# EAGLE design command_radiateur (EAGLE 6.6.0)
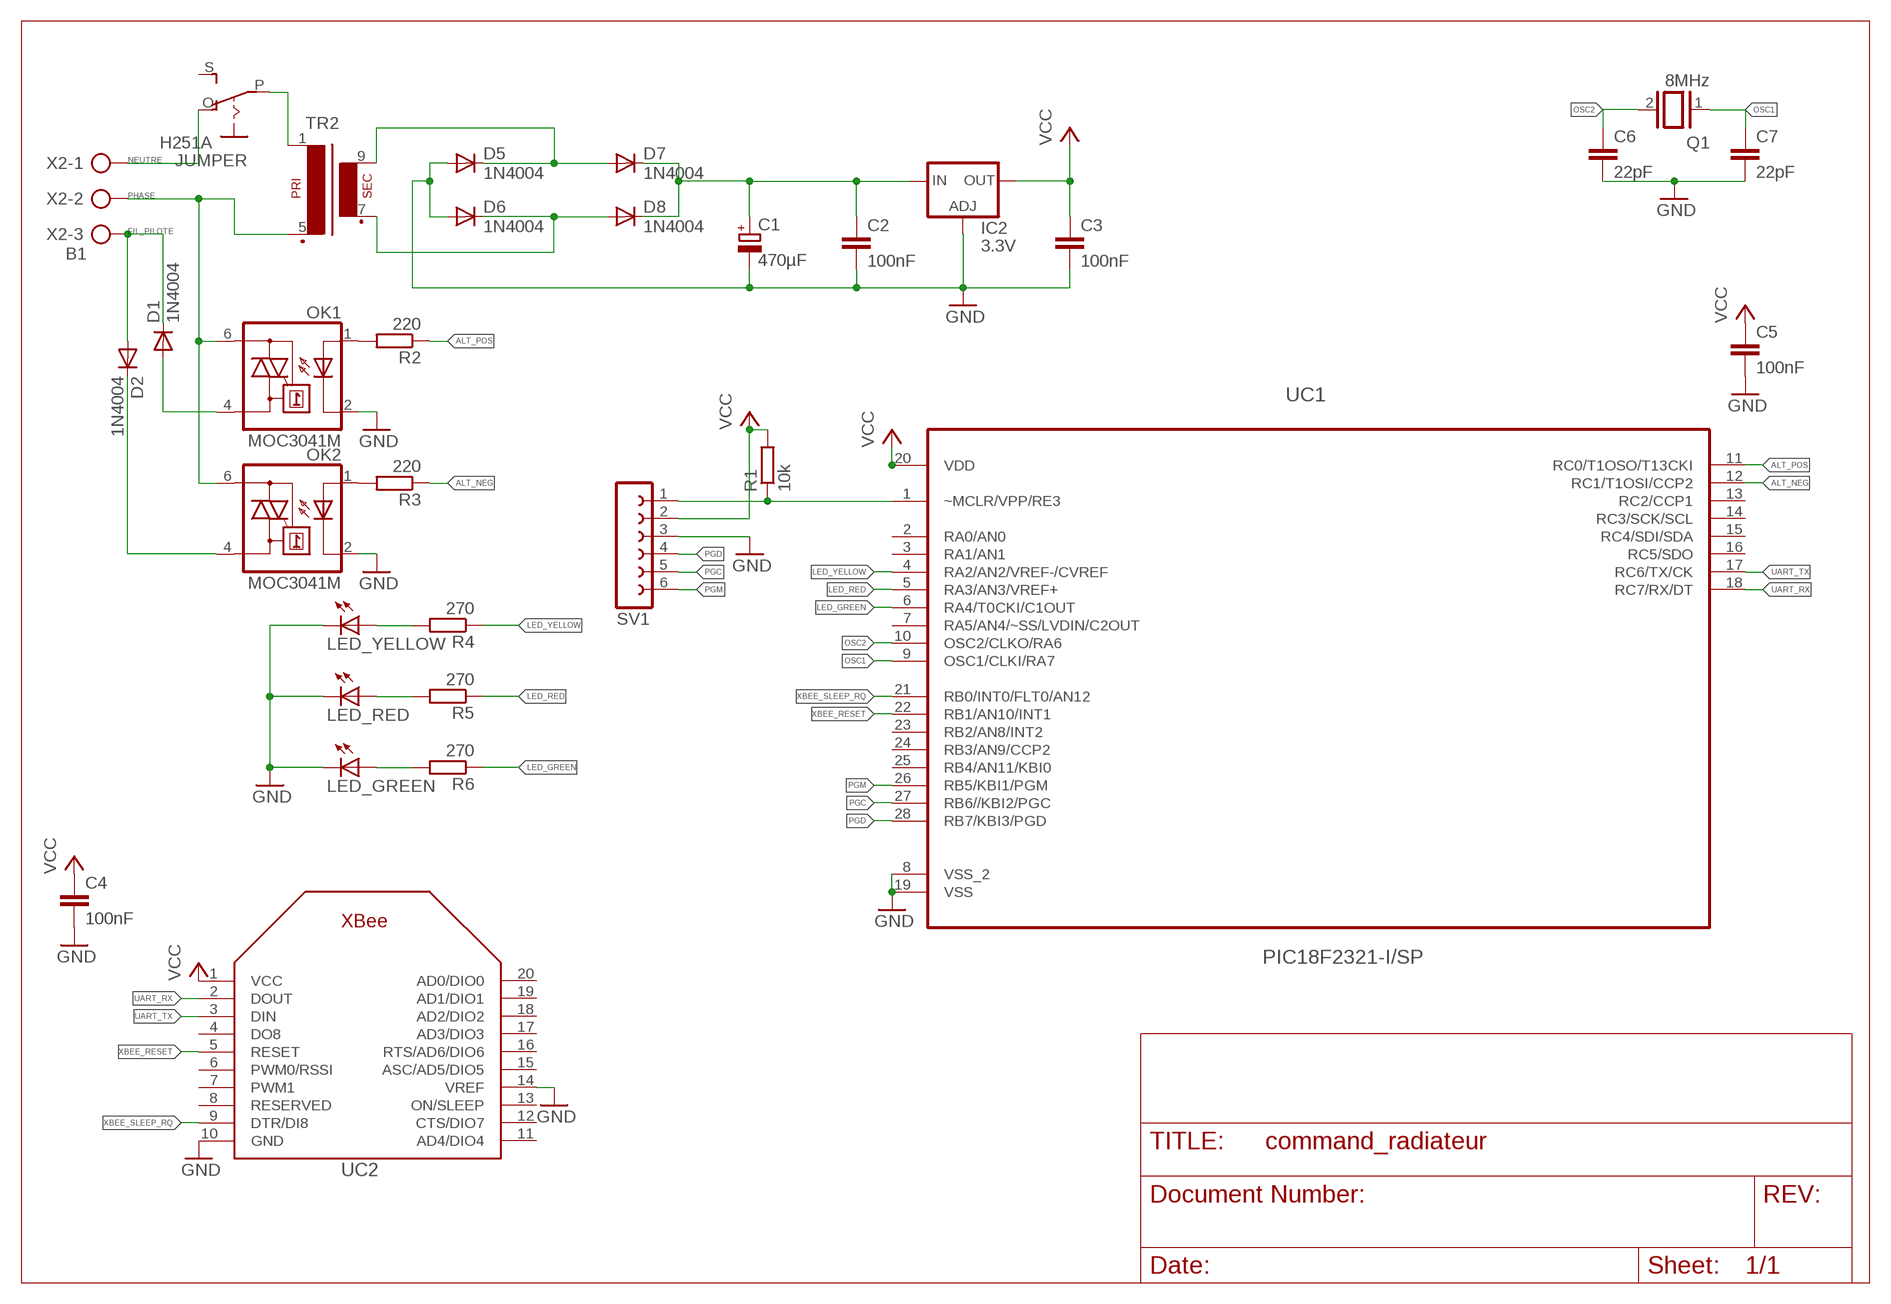
[diagram p0: schematic, sheet 1]

## Parts
C1  470µF  CPOL-EUE5-10.5  [E5-10,5]
C2  100nF  C-EU050-030X075  [C050-030X075]
C3  100nF  C-EU050-030X075  [C050-030X075]
C4  100nF  C-EU050-030X075  [C050-030X075]
C5  100nF  C-EU050-030X075  [C050-030X075]
C6  22pF  C-EU025-024X044  [C025-024X044]
C7  22pF  C-EU025-024X044  [C025-024X044]
D1  1N4004  [DO41-10]
D2  1N4004  [DO41-10]
D5  1N4004  [DO41-10]
D6  1N4004  [DO41-10]
D7  1N4004  [DO41-10]
D8  1N4004  [DO41-10]
IC2  3.3V  LM317TS  [317TS]
JUMPER  H251A  [H251A]
LED_GREEN  LED3MM  [LED3MM]
LED_RED  LED3MM  [LED3MM]
LED_YELLOW  LED3MM  [LED3MM]
OK1  MOC3041M  [DIL06]
OK2  MOC3041M  [DIL06]
Q1  8MHz  XTAL/S  [QS]
R1  10k  R-EU_0204/7  [0204/7]
R2  220  R-EU_0204/7  [0204/7]
R3  220  R-EU_0204/7  [0204/7]
R4  270  R-EU_0204/7  [0204/7]
R5  270  R-EU_0204/7  [0204/7]
R6  270  R-EU_0204/7  [0204/7]
SV1  FE06-1  [FE06]
TR2  VV11  [VV11]
UC1  PIC18F2321-I/SP  [DIP254P762X508-28]
UC2  XBEE  [XBEE]
X2  B1  AK300/3  [AK300/3]

## Nets
ALT_NEG: R3.1 UC1.12(RC1/T1OSI/CCP2)
ALT_POS: R2.1 UC1.11(RC0/T1OSO/T13CKI)
FIL_PILOTE: D1.C D2.A X2.3
GND: C1.- C2.2 C3.2 C4.2 C5.2 C6.2 C7.2 D5.A D6.A IC2.1(ADJ) LED_GREEN.K(C) LED_RED.K(C) LED_YELLOW.K(C) OK1.2(C) OK2.2(C) SV1.3 UC1.8(VSS_2) UC1.19(VSS) UC2.10(GND) UC2.14(VREF)
LED_GREEN: R6.1 UC1.6(RA4/T0CKI/C1OUT)
LED_RED: R5.1 UC1.5(RA3/AN3/VREF+)
LED_YELLOW: R4.1 UC1.4(RA2/AN2/VREF-/CVREF)
N1: JUMPER.P TR2.1
N$1: R1.1 SV1.1 UC1.1(~MCLR/VPP/RE3)
N$2: OK1.1(A) R2.2
N$3: OK2.1(A) R3.2
N$4: D1.A OK1.4(A1)
N$7: D5.C D7.A TR2.9(S4)
N$8: D6.C D8.A TR2.7(S3)
N$10: C1.+ C2.1 D7.C D8.C IC2.3(IN)
N$11: D2.C OK2.4(A1)
N$12: LED_YELLOW.A R4.2
N$13: LED_RED.A R5.2
N$14: LED_GREEN.A R6.2
NEUTRE: JUMPER.O X2.1
OSC1: C7.1 Q1.1 UC1.9(OSC1/CLKI/RA7)
OSC2: C6.1 Q1.2 UC1.10(OSC2/CLKO/RA6)
PGC: SV1.5 UC1.27(RB6//KBI2/PGC)
PGD: SV1.4 UC1.28(RB7/KBI3/PGD)
PGM: SV1.6 UC1.26(RB5/KBI1/PGM)
PHASE: OK1.6(A2) OK2.6(A2) TR2.5(P2) X2.2
UART_RX: UC1.18(RC7/RX/DT) UC2.2(DOUT)
UART_TX: UC1.17(RC6/TX/CK) UC2.3(DIN)
VCC: C3.1 C4.1 C5.1 IC2.2(OUT) R1.2 SV1.2 UC1.20(VDD) UC2.1(VCC)
XBEE_RESET: UC1.22(RB1/AN10/INT1) UC2.5(RESET)
XBEE_SLEEP_RQ: UC1.21(RB0/INT0/FLT0/AN12) UC2.9(DTR/DI8)
Unconnected: JUMPER.S UC1.2(RA0/AN0) UC1.3(RA1/AN1) UC1.7(RA5/AN4/~SS/LVDIN/C2OUT) UC1.13(RC2/CCP1) UC1.14(RC3/SCK/SCL) UC1.15(RC4/SDI/SDA) UC1.16(RC5/SDO) UC1.23(RB2/AN8/INT2) UC1.24(RB3/AN9/CCP2) UC1.25(RB4/AN11/KBI0) UC2.4(DO8) UC2.6(PWM0/RSSI) UC2.7(PWM1) UC2.8(RESERVED) UC2.11(AD4/DIO4) UC2.12(CTS/DIO7) UC2.13(ON/SLEEP) UC2.15(ASC/AD5/DIO5) UC2.16(RTS/AD6/DIO6) UC2.17(AD3/DIO3) UC2.18(AD2/DIO2) UC2.19(AD1/DIO1) UC2.20(AD0/DIO0)

## Library data of the parts
C1 = rcl:CPOL-EU: POLARIZED CAPACITOR, European symbol
C2-C7 = rcl:C-EU: CAPACITOR, European symbol
D1 D2 D5-D8 = diode:1N4004: DIODE general purpose rectifier, 1 A
IC2 = v-reg:LM317TS: VOLTAGE REGULATOR
JUMPER = ma_libs:H251A: Inverseur unipolaire H251A
LED_GREEN LED_RED LED_YELLOW = led:LED: LED OSRAM: - CHIPLED LG R971, LG N971, LY N971, LG Q971, LY Q971, LO R971, LY R971 LH N974, LH R974 LS Q976, LO Q976, LY Q976 LO Q996 - Hyper CHIPLED LW Q18S LB Q993, LB Q99A, LB R99A - SideLED LS A670, LO A670, LY A670, LG A670, LP A670 LB A673, LV A673, LT A673, LW A673 LH A674 LY A675 LS A676, LA A676, LO A676, LY A676, LW A676 LS A679, LY A679, LG A679 - Hyper Micro SIDELED® LS Y876, LA Y876, LO Y876, LY Y876 LT Y87S - SmartLED LW L88C, LW L88S LB L89C, LB L89S, LG L890 LS L89K, LO L89K, LY L89K LS L896, LA L896, LO L896, LY L896 - TOPLED LS T670, LO T670, LY T670, LG T670, LP T670 LSG T670, LSP T670, LSY T670, LOP T670, LYG T670 LG T671, LOG T671, LSG T671 LB T673, LV T673, LT T673, LW T673 LH T674 LS T676, LA T676, LO T676, LY T676, LB T676, LH T676, LSB T676, LW T676 LB T67C, LV T67C, LT T67C, LS T67K, LO T67K, LY T67K, LW E67C LS E67B, LA E67B, LO E67B, LY E67B, LB E67C, LV E67C, LT E67C LW T67C LS T679, LY T679, LG T679 LS T770, LO T770, LY T770, LG T770, LP T770 LB T773, LV T773, LT T773, LW T773 LH T774 LS E675, LA E675, LY E675, LS T675 LS T776, LA T776, LO T776, LY T776, LB T776 LHGB T686 LT T68C, LB T68C - Hyper Mini TOPLED® LB M676 - Mini TOPLED Santana® LG M470 LS M47K, LO M47K, LY M47K Source: http://www.osram.convergy.de LUXEON: - LUMILED® LXK2-PW12-R00, LXK2-PW12-S00, LXK2-PW14-U00, LXK2-PW14-V00 LXK2-PM12-R00, LXK2-PM12-S00, LXK2-PM14-U00 LXK2-PE12-Q00, LXK2-PE12-R00, LXK2-PE12-S00, LXK2-PE14-T00, LXK2-PE14-U00 LXK2-PB12-K00, LXK2-PB12-L00, LXK2-PB12-M00, LXK2-PB14-N00, LXK2-PB14-P00, LXK2-PB14-Q00 LXK2-PR12-L00, LXK2-PR12-M00, LXK2-PR14-Q00, LXK2-PR14-R00 LXK2-PD12-Q00, LXK2-PD12-R00, LXK2-PD12-S00 LXK2-PH12-R00, LXK2-PH12-S00 LXK2-PL12-P00, LXK2-PL12-Q00, LXK2-PL12-R00 Source: www.luxeon.com KINGBRIGHT: KA-3528ASYC Source: www.kingbright.com
OK1 OK2 = optocoupler:MOC30*: 6-Pin DIP Zero-Cross Optoisolators Triac Driver Output (250/400 Volt Peak) Source: Data sheet <http://www.fairchildsemi.com/ds/MO/MOC3031M.pdf> The old path of data sheet not more available 2013-05-06.; MF: FAIRCHILD SEMICONDUCTOR; MPN: MOC3041M; OC_FARNELL: 1086677; OC_NEWARK: 78K6090
Q1 = special:XTAL/S: CRYSTAL
R1-R6 = rcl:R-EU_: RESISTOR, European symbol
SV1 = con-lsta:FE06-1: FEMALE HEADER; OC_FARNELL: unknown; OC_NEWARK: unknown
TR2 = trafo:VV11: TRANSFORMER 1 primary winding, 1 secondary winding BLOCK
UC1 = Microchip_By_element14_Batch_1:PIC18F2321-I/SP: High-Performance Enhanced Flash Microcontrollers; MPN: PIC18F2321-I/SP; OC_FARNELL: 1332236; OC_NEWARK: 31K5012; PACKAGE: DIP-28; SUPPLIER: Microchip
UC2 = adafruit:XBEE
X2 = con-ptr500:AK300/3: CONNECTOR; OC_FARNELL: unknown; OC_NEWARK: unknown

## Board
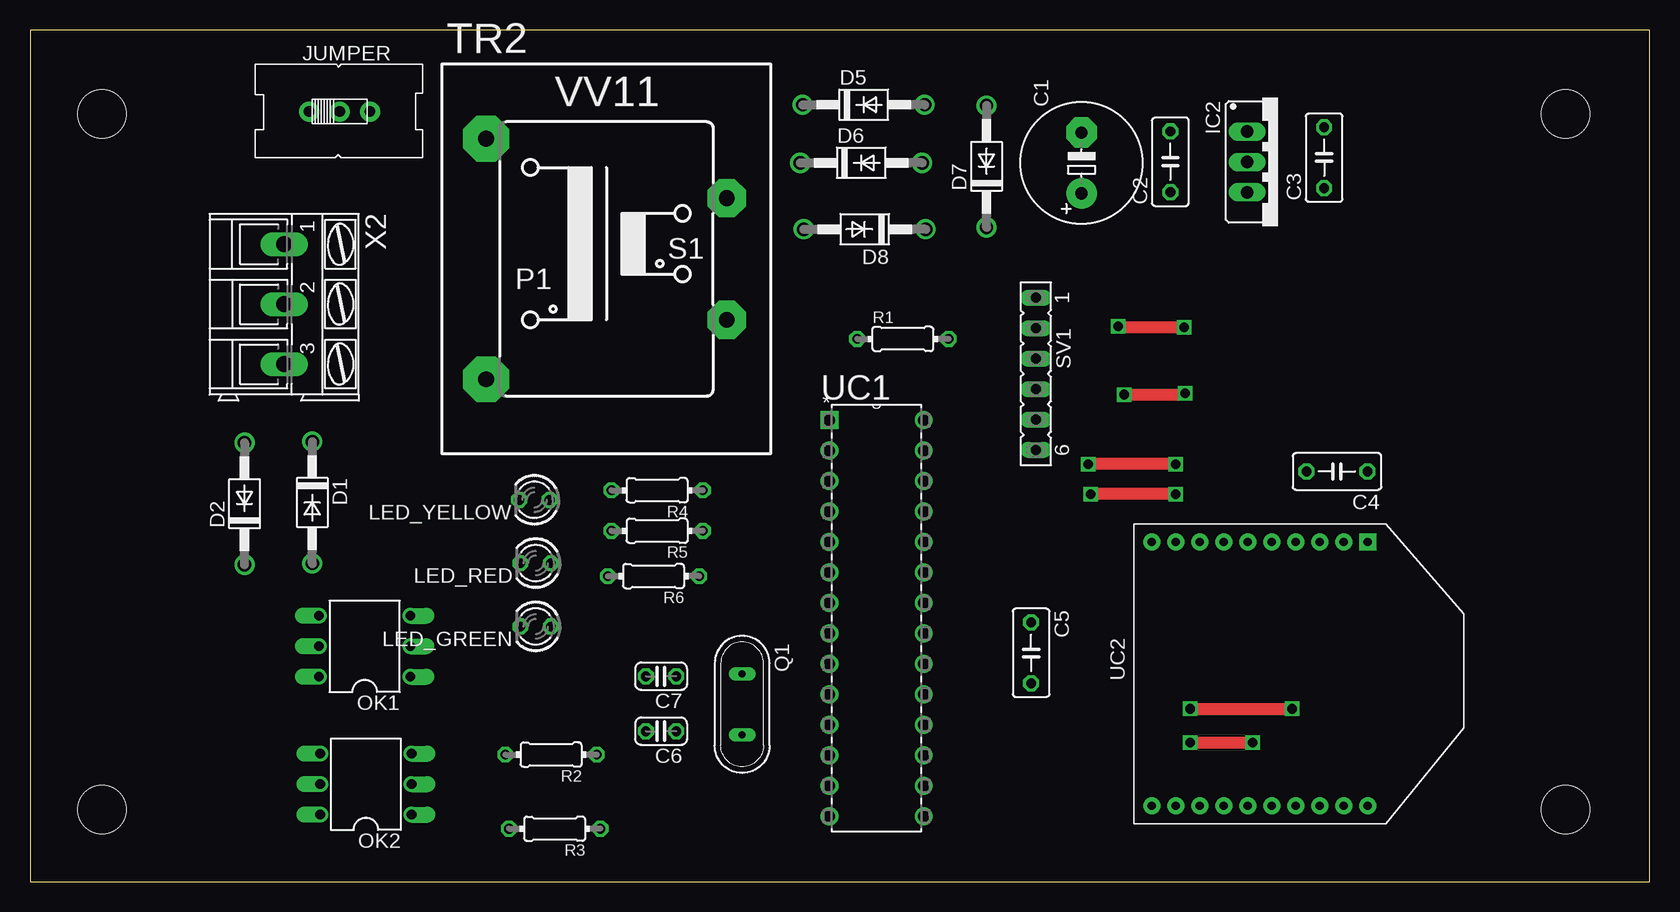
[diagram p1: board, top side]
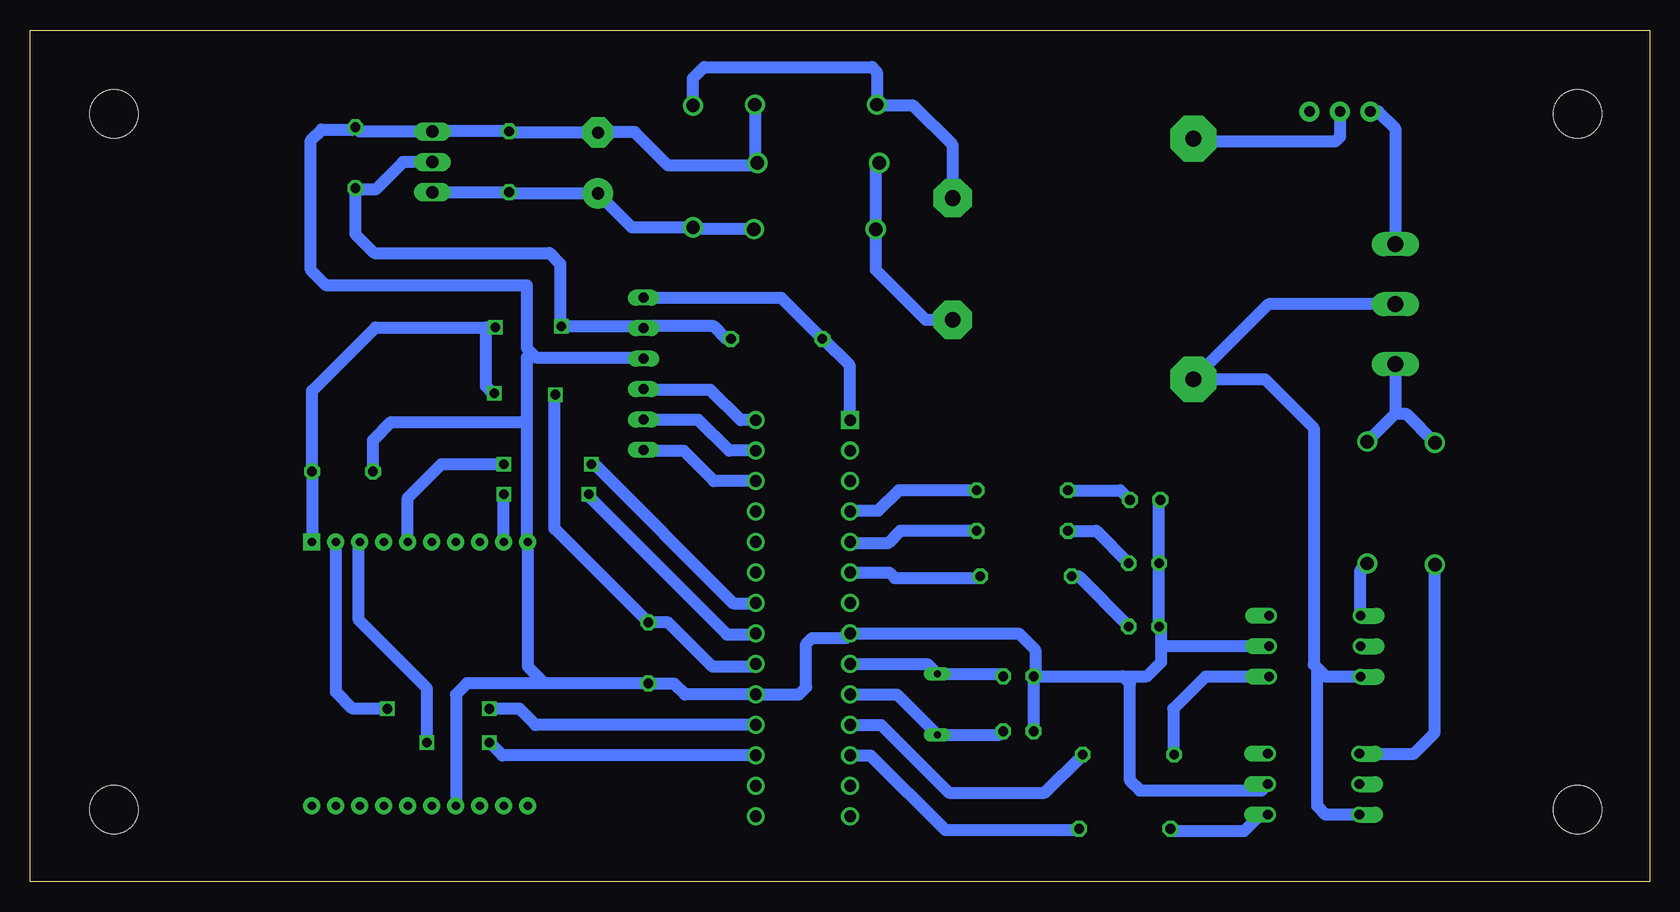
[diagram p2: board, bottom side, seen from below]

Size 135 x 71 mm. Coordinates in mm from the lower left corner, seen from the top.
Outline: 0,0 135,0 135,71 0,71 0,0
Copper layers (1*16): Top 0.035mm / dielectric 1.5mm / Bottom 0.035mm
Design rules "default": minimum track width 10mil, minimum drill 24mil, track to track 8mil, track to pad 8mil, pad to pad 8mil, via to via 8mil, smd to smd 8mil, copper to edge 40mil, drill to drill 8mil, minimum pad ring 10mil, minimum via ring 8mil, stop-mask expansion 4mil, vias tented up to drill 0mil, thermal gap 10mil
Holes 4 mm at 6,64 6,6 128,6 128,64

### Footprints (pad centres in the part's own frame; a part is rotated, then mirrored left to right if it is on the bottom)
E5-10,5 = drill 1.016 pad 2.54: + -2.54,0 | drill 1.016 pad 2.54 octagon: - 2.54,0
C050-030X075 = drill 0.813 octagon: 1 -2.54,0; 2 2.54,0
C025-024X044 = drill 0.813 octagon: 1 -1.27,0; 2 1.27,0
DO41-10 = drill 1.118: A 5.08,0; C -5.08,0
317TS = drill 1.016 long: 1 -2.54,-2.54; 2 0,-2.54; 3 2.54,-2.54
H251A = drill 0.9 pad 1.676: O -2.54,0; P 0,0; S 2.54,0
LED3MM = drill 0.813 octagon: A -1.27,0; K 1.27,0
DIL06 = drill 0.813 offset: 1 -2.54,-3.81; 2 0,-3.81; 3 2.54,-3.81; 4 2.54,3.81; 5 0,3.81; 6 -2.54,3.81
QS = drill 0.61 long: 1 -2.54,0; 2 2.54,0
0204/7 = drill 0.813 octagon: 1 -3.81,0; 2 3.81,0
FE06 = drill 0.813 long: 1 -6.35,0; 2 -3.81,0; 3 -1.27,0; 4 1.27,0; 5 3.81,0; 6 6.35,0
VV11 = drill 1.321 pad 3.81 octagon: 1 -10.033,10.033; 5 -10.033,-10.033 | drill 1.321 pad 3.175 octagon: 7 10.033,-5.08; 9 10.033,5.08
DIP254P762X508-28 = drill 0.991 square: 1 -7.874,33.02 | drill 0.991: 2 -7.874,30.48; 3 -7.874,27.94; 4 -7.874,25.4; 5 -7.874,22.86; 6 -7.874,20.32; 7 -7.874,17.78; 8 -7.874,15.24; 9 -7.874,12.7; 10 -7.874,10.16; 11 -7.874,7.62; 12 -7.874,5.08; 13 -7.874,2.54; 14 -7.874,0; 15 0,0; 16 0,2.54; 17 0,5.08; 18 0,7.62; 19 0,10.16; 20 0,12.7; 21 0,15.24; 22 0,17.78; 23 0,20.32; 24 0,22.86; 25 0,25.4; 26 0,27.94; 27 0,30.48; 28 0,33.02
XBEE = drill 0.7 pad 1.422 square: 1 -11,5.5 | drill 0.7 pad 1.422: 2 -11,3.5; 3 -11,1.5; 4 -11,-0.5; 5 -11,-2.5; 6 -11,-4.5; 7 -11,-6.5; 8 -11,-8.5; 9 -11,-10.5; 10 -11,-12.5; 11 11,-12.5; 12 11,-10.5; 13 11,-8.5; 14 11,-6.5; 15 11,-4.5; 16 11,-2.5; 17 11,-0.5; 18 11,1.5; 19 11,3.5; 20 11,5.5
AK300/3 = drill 1.321 long: 1 -5.004,0; 2 0,0; 3 5.004,0

### Placement (x,y rotation side)
C1  87.65,59.91 90 top
C2  95.06,60.01 90 top
C3  107.88,60.35 90 top
C4  108.95,34.19 180 top
C5  83.45,19.07 270 top
C6  52.61,12.53 180 top
C7  52.61,17.11 180 top
D1  23.53,31.6 270 top
D2  17.88,31.5 90 top
D5  69.49,64.77 0 top
D6  69.29,59.92 0 top
D7  79.73,59.62 90 top
D8  69.58,54.38 180 top
IC2  104,60 270 top
JUMPER  25.8,64.2 0 top
LED_GREEN  42.15,21.26 180 top
LED_RED  42.15,26.54 180 top
LED_YELLOW  42.05,31.82 180 top
OK1  27.9,19.62 90 top
OK2  28,8.12 90 top
Q1  59.36,14.77 270 top
R1  72.76,45.24 0 top
R2  43.44,10.58 180 top
R3  43.74,4.4 180 top
R4  52.28,32.62 180 top
R5  52.28,29.24 180 top
R6  51.98,25.46 180 top
SV1  83.85,42.33 270 top
TR2  48.05,51.91 0 top
UC1  74.5,5.44 0 top
UC2  106.01,17.31 270 top
X2  21.19,48.14 270 top

### Tracks (layer width: path | path; a pad name or v marks a point on that pad's centre or on a via)
ALT_NEG
  Bottom 1.016: UC1.12 64.92,10.52 58.7,4.3 47.65,4.3 R3.1
ALT_POS
  Bottom 1.016: UC1.11 64.06,13.06 58.4,7.4 50.43,7.4 R2.1
FIL_PILOTE
  Bottom 1.016: X2.3 21.19,39.02 | 21.19,39.02 D1.C | 21.19,39.02 20.32,39.02 D2.A
GND
  Bottom 1.016: C7.2 51.2,17.25 51.2,19.3 52.58,20.68 UC1.8 67.01,20.3 69.8,20.3 70.3,19.8 70.3,16.2 70.9,15.6 UC1.19 80.4,15.6 81.3,16.5 83.42,16.5 C5.2 92.1,16.53 | C7.2 C6.2 | C7.2 43.9,17.11 | 43.9,17.11 41.89,17.11 40.7,18.3 40.7,19.8 | 40.7,19.8 40.7,21.08 LED_GREEN.K LED_RED.K 40.88,31.72 LED_YELLOW.K | 92.8,43.7 93.6,44.5 93.6,49.7 110.3,49.7 111.6,51 111.6,61.8 110.7,62.7 108.07,62.7 C3.2 107.53,62.54 IC2.1 C2.2 94.96,62.45 C1.- 87.6,62.5 84.6,62.5 81.8,59.7 74.4,59.7 74.57,59.87 D5.A 74.57,60.12 D6.A | 92.8,43.7 83.95,43.7 SV1.3 | 92.8,43.7 93.6,43.7 93.6,38.2 | 93.6,38.2 93.6,28.4 UC2.10 93.51,17.94 92.1,16.53 | C4.2 106.41,36.79 104.9,38.3 93.7,38.3 93.6,38.2 | 99.6,6.22 UC2.14 99.5,15.6 98.57,16.53 92.1,16.53 | 43.9,17.11 43.3,16.51 43.3,8.4 42.5,7.6 32.33,7.6 OK2.2 | OK1.2 40.52,19.62 40.7,19.8
LED_GREEN
  Bottom 1.016: UC1.6 63.36,25.76 62.9,25.3 55.95,25.3 R6.1
LED_RED
  Bottom 1.016: R5.1 62.46,29.24 63.5,28.2 66.53,28.2 UC1.5
LED_YELLOW
  Bottom 1.016: R4.1 62.58,32.62 64.3,30.9 66.57,30.9 UC1.4
N1
  Bottom 1.016: JUMPER.P 25.8,62.1 26.2,61.7 37.77,61.7 TR2.1
N$1
  Bottom 1.016: SV1.1 72.39,48.68 R1.1 68.84,45.24 66.7,43.1 66.7,38.53 UC1.1
N$2
  Bottom 1.016: OK1.1 37.02,17.08 39.7,14.4 39.7,10.65 R2.2
N$3
  Bottom 1.016: 39.83,4.3 R3.2 39.73,4.2 33.8,4.2 32.42,5.58 OK2.1
N$4
  Bottom 1.016: OK1.4 24.09,25.96 D1.A
N$7
  Bottom 1.016: TR2.9 58.08,61.38 61.4,64.7 64.34,64.7 D5.C 64.4,67.5 64.8,67.9 78.8,67.9 79.73,66.97 D7.A
N$8
  Bottom 1.016: TR2.7 60.33,46.83 64.5,51 D8.A 64.5,59.63 D6.C
N$10
  Bottom 1.016: D8.C 79.57,54.38 D7.C 84.82,54.54 C1.+ 94.96,57.37 C2.1 IC2.3
N$11
  Bottom 1.016: OK2.4 19.64,10.66 17.9,12.4 17.9,26.4 D2.C
N$12
  Bottom 1.016: R4.2 44.12,32.62 LED_YELLOW.A
N$13
  Bottom 1.016: R5.2 46.12,29.24 LED_RED.A
N$14
  Bottom 1.016: R6.2 47.62,25.46 LED_GREEN.A
NEUTRE
  Bottom 1.016: JUMPER.O 22.6,64.2 21.2,62.8 21.2,53.15 X2.1
OSC1
  Bottom 1.016: UC1.9 60.19,18.14 Q1.1 54.08,17.31 C7.1
OSC2
  Bottom 1.016: UC1.10 62.73,15.6 Q1.2 54.18,12.23 C6.1
PGC
  Bottom 1.016: UC1.27 76.72,35.92 79.3,38.5 83.83,38.5 SV1.5
PGD
  Bottom 1.016: UC1.28 75.76,38.46 78.3,41 83.79,41 SV1.4
PGM
  Bottom 1.016: UC1.26 77.98,33.38 80.5,35.9 83.77,35.9 SV1.6
PHASE
  Bottom 1.016: X2.2 31.75,48.14 TR2.5 32.08,41.88 28,37.8 28,18.1 27.7,17.8 | 27.7,17.8 27,17.1 24.11,17.1 OK1.6 | OK2.6 26.98,5.58 27.7,6.3 27.7,17.8
UART_RX  (via drill 0.8)
  Top 1.016: v96.7,14.4 v105.2,14.4
  Bottom 1.016: UC1.18 92.86,13.06 94.2,14.4 v96.7,14.4 | v105.2,14.4 108.1,14.4 109.5,15.8 UC2.2
UART_TX  (via drill 0.8)
  Top 1.016: v96.7,11.6 v101.9,11.6
  Bottom 1.016: UC1.17 95.62,10.52 v96.7,11.6 | v101.9,11.6 101.9,16.1 107.6,21.8 107.6,28.22 UC2.3
VCC  (via drill 0.8)
  Top 1.016: v96.2,46.2 90.8,46.2 v90.7,46.3 | v91.2,40.6 96.2,40.6 v96.3,40.7
  Bottom 1.016: C4.1 | R1.2 76.94,45.24 78,46.3 83.69,46.3 SV1.2 84.01,46.3 v90.7,46.3 90.8,46.4 90.8,51.5 91.7,52.4 106.3,52.4 107.88,53.98 C3.1 107.77,57.7 106.2,57.7 103.9,60 IC2.2 | 97,46.2 106.2,46.2 111.49,40.91 C4.1 | 97,46.2 v96.2,46.2 | v91.2,40.6 91.3,40.5 91.3,29.4 91.24,29.4 C5.1 81.8,21.6 78.1,17.9 74.74,17.9 UC1.20 | v96.3,40.7 96.4,40.7 97,41.3 97,46.2 | C4.1 111.49,28.33 UC2.1
XBEE_RESET  (via drill 0.8)
  Top 1.016: v95.5,34.8 v88.2,34.8
  Bottom 1.016: UC2.5 103.51,31.99 100.7,34.8 v95.5,34.8 | v88.2,34.8 88,34.8 76.4,23.2 74.52,23.2 UC1.22
XBEE_SLEEP_RQ  (via drill 0.8)
  Top 1.016: v95.5,32.3 v88.4,32.3
  Bottom 1.016: UC2.9 v95.51,32.29 v95.5,32.3 | v88.4,32.3 88.4,32.1 76.9,20.6 74.58,20.6 UC1.21